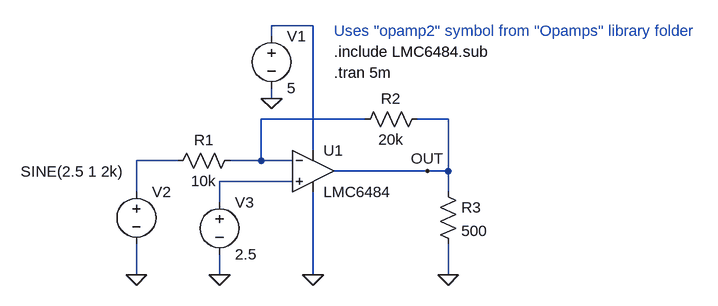
[diagram p0: schematic LMC6484.asc]
LMC6484.asc, the LTspice schematic file:
Version 4
SHEET 1 880 680
WIRE 80 0 16 0
WIRE 16 16 16 0
WIRE 16 112 16 96
WIRE 160 144 0 144
WIRE 288 144 240 144
WIRE 80 192 80 0
WIRE -128 208 -192 208
WIRE 0 208 0 144
WIRE 0 208 -48 208
WIRE 48 208 0 208
WIRE 256 224 112 224
WIRE 288 224 288 144
WIRE 288 224 256 224
WIRE 48 240 -64 240
WIRE -192 256 -192 208
WIRE 288 256 288 224
WIRE -64 272 -64 240
WIRE -192 384 -192 336
WIRE -64 384 -64 352
WIRE 80 384 80 256
WIRE 288 384 288 336
FLAG 80 384 0
FLAG -64 384 0
FLAG -192 384 0
FLAG 16 112 0
FLAG 256 224 OUT
FLAG 288 384 0
SYMBOL Opamps\\opamp2 80 160 R0
SYMATTR InstName U1
SYMATTR Value LMC6484
SYMBOL voltage 16 0 R0
SYMATTR InstName V1
SYMATTR Value 5
SYMBOL res -32 192 R90
WINDOW 0 0 56 VBottom 2
WINDOW 3 32 56 VTop 2
SYMATTR InstName R1
SYMATTR Value 10k
SYMBOL res 256 128 R90
WINDOW 0 0 56 VBottom 2
WINDOW 3 32 56 VTop 2
SYMATTR InstName R2
SYMATTR Value 20k
SYMBOL voltage -192 240 R0
WINDOW 3 -178 -15 Left 2
WINDOW 123 -106 -102 Left 2
WINDOW 39 0 0 Left 2
SYMATTR Value SINE(2.5 1 2k)
SYMATTR InstName V2
SYMBOL voltage -64 256 R0
WINDOW 123 0 0 Left 2
WINDOW 39 0 0 Left 2
SYMATTR InstName V3
SYMATTR Value 2.5
SYMBOL res 272 240 R0
SYMATTR InstName R3
SYMATTR Value 500
TEXT 112 40 Left 2 !.include LMC6484.sub
TEXT 112 72 Left 2 !.tran 5m
TEXT 112 8 Left 2 ;Uses "opamp2" symbol from "Opamps" library folder

The netlist it stands for:
* LMC6484.asc
XU1 N004 N002 N001 0 OUT LMC6484  ; pins In+ In- V+ V- OUT
V1 N001 0 5
R1 N002 N003 10k
R2 OUT N002 20k
V2 N003 0 SINE(2.5 1 2k)
V3 N004 0 2.5
R3 OUT 0 500
.include LMC6484.sub
.tran 5m
* Uses "opamp2" symbol from "Opamps" library folder
.backanno
.end